# Altium schematic sheet 04 MP_SIGNAL.SchDoc
size A4
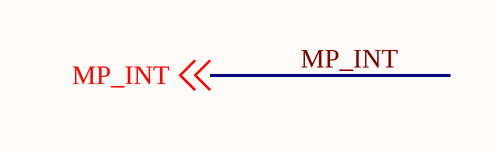
[diagram p0: 04 MP_SIGNAL.SchDoc]